# Altium schematic sheet HLib-ADCDevices.SchDoc: HLib - ADC devices
size A; DrawnBy: Nhat Pham; DocumentNumber: 1; Revision: 0.1; SheetNumber: 1; DocumentName: HLib - ADC devices; ProjectName: HLib
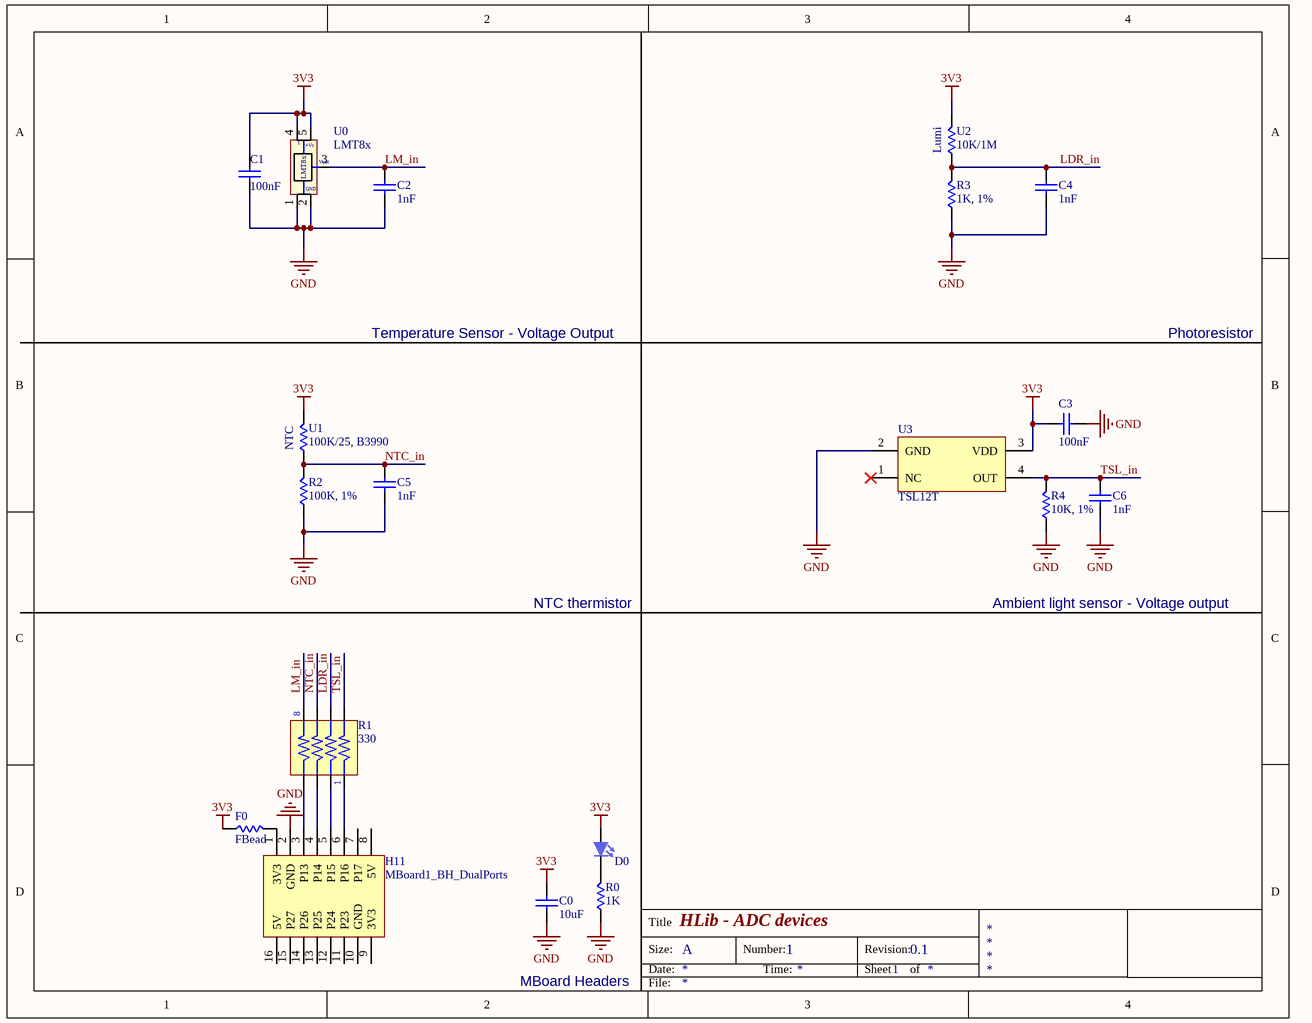
[diagram p0: HLib-ADCDevices.SchDoc]

## Parts
C0  value 10uF  [SM_0805_C_CERAMIC]  (hidden comment: C_Ceramic)
C1  value 100nF  [SM_0805_C_CERAMIC]  (hidden comment: C_Ceramic)
C2  value 1nF  [SM_0805_C_CERAMIC]  (hidden comment: C_Ceramic)
C3  value 100nF  [SM_0805_C_CERAMIC]  (hidden comment: C_Ceramic)
C4  value 1nF  [SM_0805_C_CERAMIC]  (hidden comment: C_Ceramic)
C5  value 1nF  [SM_0805_C_CERAMIC]  (hidden comment: C_Ceramic)
C6  value 1nF  [SM_0805_C_CERAMIC]  (hidden comment: C_Ceramic)
D0  LED  [SM_0805_LED]  (value not drawn)
F0  value FBead  [SM_0805_R]  (hidden comment: R)
H11  MBoard1_BH_DualPorts  [MBoard1_BH_DualPorts]
R0  value 1K  [SM_0805_R]  (hidden comment: R)
R1  330  [RA4]
R2  value 100K, 1%  [SM_0805_R]
R3  value 1K, 1%  [SM_0805_R]
R4  value 10K, 1%  [SM_0805_R]
U0  LMT8x  [SC70-5]
U1  NTC  value 100K/25, B3990  [R1/4W]
U2  Lumi  value 10K/1M  [PhotoRes-5mm]
U3  TSL12T  [4-LEAD SMD]

## Nets
3V3: C0.2 C1.2 C3.2 D0.1(A) F0.1 U0.4(+Vs) U0.5(+Vs) U1.2 U2.2 U3.3(VDD)
GND: C0.1 C1.1 C2.1 C3.1 C4.1 C5.1 C6.1 H11.2(GND) R0.1 R2.1 R3.1 R4.1 U0.1(-) U0.2(-) U3.2(GND)
LDR_in: C4.2 R1.4 R3.2 U2.1
LM_in: C2.2 R1.8 U0.3(Vout)
NTC_in: C5.2 R1.6 R2.2 U1.1
TSL_in: C6.2 R1.2 R4.2 U3.4(OUT)
NetD0_2: D0.2(K) R0.2
NetF0_2: F0.2 H11.1(3V3)
NetH11_3: H11.3(P13) R1.7
NetH11_4: H11.4(P14) R1.5
NetH11_5: H11.5(P15) R1.3
NetH11_6: H11.6(P16) R1.1

Not connected (* = marked no-connect by the designer): H11 7(P17) 8(5V) 9(3V3) 10(GND) 11(P23) 12(P24) 13(P25) 14(P26) 15(P27) 16(5V); U3 1(NC)*

## Notes on the sheet
- Temperature Sensor - Voltage Output
- Photoresistor
- NTC thermistor
- Ambient light sensor - Voltage output
- MBoard Headers
- Title
- Size:
- Date:
- A
- Number:
- Time:
- Revision:
- Sheet
- of
- File:
- (in symbol LMT8x) GND

## Library data of the parts
C0-C6 = C_Ceramic: Non-polarity ceramic capacitor; Published: 8-Jun-2000; LatestRevisionDate: 17-Jul-2002; LatestRevisionNote: Re-released for DXP Platform.; PackageReference: RAD-0.3; Publisher: Altium Limited; PackageDescription: Radial Cap, Thru-Hole; 2 Leads; 0.3 in Pin Spacing
F0 R0 R2-R4 U1 U2 = R: Resistor; Published: 8-Jun-2000; LatestRevisionDate: 29-May-2009; LatestRevisionNote: IPC-7351 Footprint Added.; PackageReference: J1-0603; Publisher: Altium Limited; PackageDescription: Chip Resistor
R1 = RA4
U3 = TSL12T: AMS TSL12T Ambient light sensor, Voltage output
D0 = LED: Published: 8-Jun-2000; LatestRevisionDate: 08-Jul-2005; LatestRevisionNote: Mech Layer 1 removed.; PackageReference: LED-1; Publisher: Altium Limited; PackageDescription: LED; 2 Leads